# Altium schematic sheet Adaptor.SchDoc
size A4
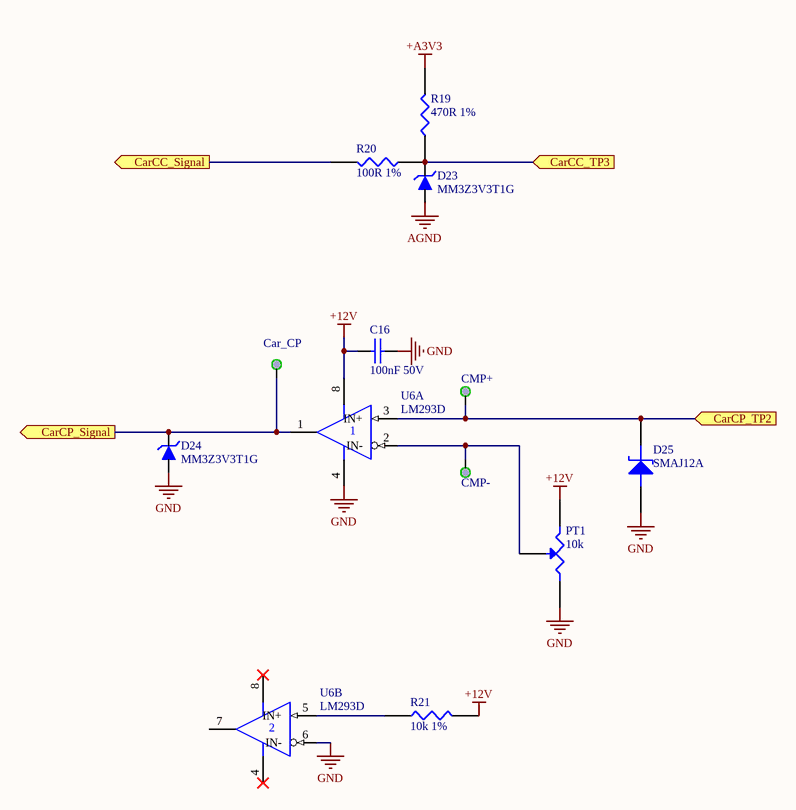
[diagram p0: Adaptor.SchDoc]

## Parts
C16  100nF 50V  [CAPC2012N]
Car_CP  IR PULSE  [TP1.4/1.0]  (value not drawn)  (no BOM)
CMP+  CMP+  [TP1.4/1.0]  (value not drawn)  (no BOM)
CMP-  CMP-  [TP1.4/1.0]  (value not drawn)  (no BOM)
D23  MM3Z3V3T1G  [SOD-323]
D24  MM3Z3V3T1G  [SOD-323]
D25  SMAJ12A  [DSO-C2/G1.6]
PT1  10k  [VR-3362P]
R19  470R 1%  [RESC2012N]
R20  100R 1%  [RESC2012N]
R21  10k 1%  [RESC2012N]
U6  LM293D  [SO8_M]  (parts A,B of 2)

## Ports
CarCC_Signal (out), CarCC_TP3 (in), CarCP_Signal (out), CarCP_TP2 (in)

## Nets
+12V: C16.2 PT1.1 R21.2 U6.8(VCC)
+A3V3: R19.2
AGND: D23.2(A)
GND: C16.1 D24.2(A) D25.1(A) PT1.3 U6.4(GND) U6.6(IN-)
CarCC_Signal: R20.2 ; port CarCC_Signal
CarCC_TP3: D23.1(K) R19.1 R20.1 ; port CarCC_TP3
CarCP_Signal: Car_CP.1 D24.1(K) U6.1(OUT) ; port CarCP_Signal
CarCP_TP2: CMP+.1 D25.2(K) U6.3(IN+) ; port CarCP_TP2
NetCMP-_1: CMP-.1 PT1.2(W) U6.2(IN-)
NetR21_1: R21.1 U6.5(IN+)

Not connected (* = marked no-connect by the designer): U6 7(OUT)

## Library data of the parts
C16 = CAP: Capacitor; Price: 0.025
Car_CP CMP+ CMP- = TP1.4/1.0
D23 D24 = Zener Diode: Manufacturer: ON; Price: *
D25 = ZENER2: Zener Diode; Manufacturer: Littlefuse; Price: 0.65
PT1 = POT1: 电位器; Price: 0.5
R19-R21 = RES1
U6 = LM393D: Dual Differential Comparator; Published: 15-Apr-2002; LatestRevisionDate: 13-Apr-2006; LatestRevisionNote: IPC-7351 Footprint Added.; DatasheetVersion: Nov-1988; PackageVersion: Jan-1998; PackageReference: D008; Publisher: Altium Limited; PackageDescription: 8-Pin Small Outline Integrated Circuit 1.27 mm Pitch; Code_IPC: SOIC127P600-8; ComponentLink1Description: Manufacturer Link; ComponentLink1URL: http://www.ti.com/; ComponentLink2Description: Datasheet; ComponentLink2URL: http://www-s.ti.com/sc/ds/lm193.pdf; Price: 0.8